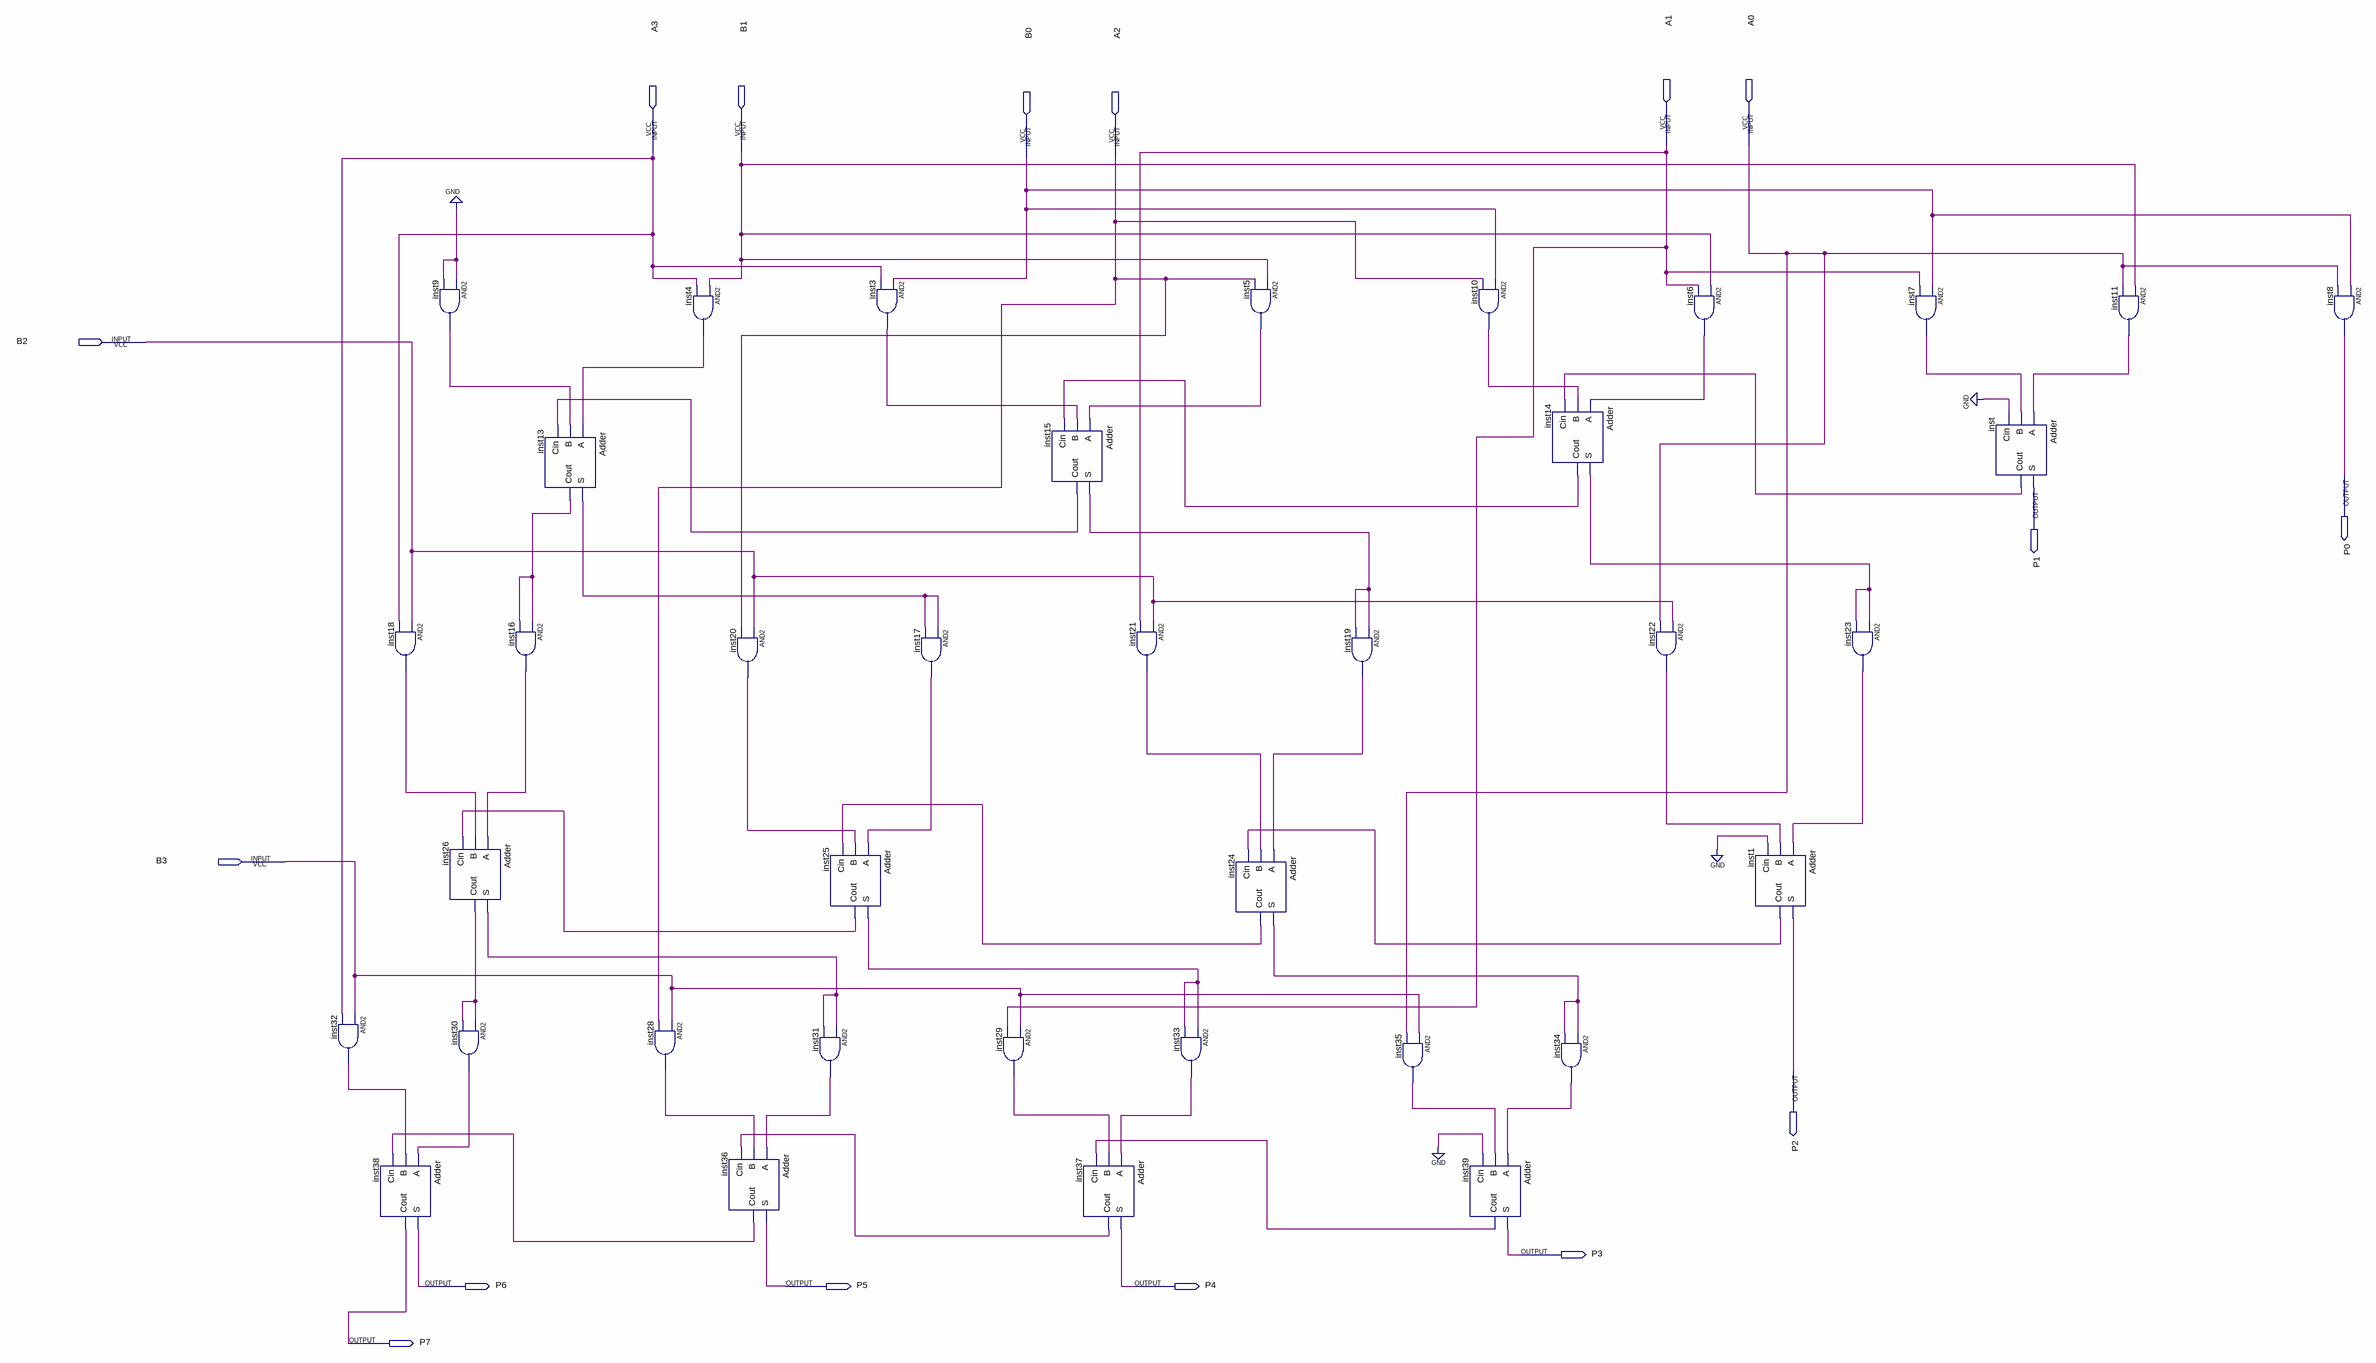
[diagram p0: schematic sheet]
// Quartus schematic 4Bit_Multiplier.bdf as structural Verilog: 37 symbols, 16 pins
module \4Bit_Multiplier  (
  input  A1,
  input  A0,
  input  A3,
  input  B1,
  input  B0,
  input  A2,
  input  B2,
  input  B3,
  output P0,
  output P1,
  output P2,
  output P3,
  output P6,
  output P5,
  output P4,
  output P7
);

  wire inst1_cout, inst3_out, inst4_out, inst5_out, inst6_out, inst7_out, inst9_out, inst10_out, inst11_out,
       inst13_cout, inst13_s, inst14_cout, inst14_s, inst15_cout, inst15_s, inst16_out, inst17_out,
       inst18_out, inst19_out, inst20_out, inst21_out, inst22_out, inst23_out, inst24_cout, inst24_s,
       inst25_cout, inst25_s, inst26_cout, inst26_s, inst28_out, inst29_out, inst30_out, inst31_out,
       inst32_out, inst33_out, inst34_out, inst35_out, inst36_cout, inst37_cout, inst39_cout, inst_cout;

  and inst32 (inst32_out, B3, A3);
  and inst18 (inst18_out, B2, A3);
  Adder inst38 (.A(inst30_out), .B(inst32_out), .Cin(inst36_cout), .S(P6), .Cout(P7));
  and inst9 (inst9_out, 1'b0, 1'b0);
  Adder inst26 (.A(inst16_out), .B(inst18_out), .Cin(inst25_cout), .S(inst26_s), .Cout(inst26_cout));
  and inst30 (inst30_out, inst26_cout, inst26_cout);
  Adder inst13 (.A(inst4_out), .B(inst9_out), .Cin(inst15_cout), .S(inst13_s), .Cout(inst13_cout));
  and inst16 (inst16_out, inst13_cout, inst13_cout);
  and inst28 (inst28_out, B3, A2);
  and inst4 (inst4_out, B1, A3);
  and inst20 (inst20_out, B2, A2);
  Adder inst36 (.A(inst31_out), .B(inst28_out), .Cin(inst37_cout), .S(P5), .Cout(inst36_cout));
  Adder inst25 (.A(inst17_out), .B(inst20_out), .Cin(inst24_cout), .S(inst25_s), .Cout(inst25_cout));
  and inst31 (inst31_out, inst26_s, inst26_s);
  and inst3 (inst3_out, B0, A3);
  and inst17 (inst17_out, inst13_s, inst13_s);
  and inst29 (inst29_out, B3, A1);
  Adder inst15 (.A(inst5_out), .B(inst3_out), .Cin(inst14_cout), .S(inst15_s), .Cout(inst15_cout));
  Adder inst37 (.A(inst33_out), .B(inst29_out), .Cin(inst39_cout), .S(P4), .Cout(inst37_cout));
  and inst21 (inst21_out, B2, A1);
  and inst33 (inst33_out, inst25_s, inst25_s);
  and inst5 (inst5_out, B1, A2);
  Adder inst24 (.A(inst19_out), .B(inst21_out), .Cin(inst1_cout), .S(inst24_s), .Cout(inst24_cout));
  and inst19 (inst19_out, inst15_s, inst15_s);
  and inst35 (inst35_out, B3, A0);
  Adder inst39 (.A(inst34_out), .B(inst35_out), .Cin(1'b0), .S(P3), .Cout(inst39_cout));
  and inst10 (inst10_out, B0, A2);
  Adder inst14 (.A(inst6_out), .B(inst10_out), .Cin(inst_cout), .S(inst14_s), .Cout(inst14_cout));
  and inst34 (inst34_out, inst24_s, inst24_s);
  and inst22 (inst22_out, B2, A0);
  and inst6 (inst6_out, B1, A1);
  Adder inst1 (.A(inst23_out), .B(inst22_out), .Cin(1'b0), .S(P2), .Cout(inst1_cout));
  and inst23 (inst23_out, inst14_s, inst14_s);
  and inst7 (inst7_out, B0, A1);
  Adder inst (.A(inst11_out), .B(inst7_out), .Cin(1'b0), .S(P1), .Cout(inst_cout));
  and inst11 (inst11_out, B1, A0);
  and inst8 (P0, B0, A0);
endmodule
